# Altium schematic sheet Amplifier.schdoc: Amplifier
size A4; Organization: Altium Limited; Address1: L3, 12a Rodborough Rd; Address2: Frenchs Forest; Address3: NSW; Address4: Australia 2086; DocumentNumber: 2; SheetNumber: 2; SheetTotal: 3
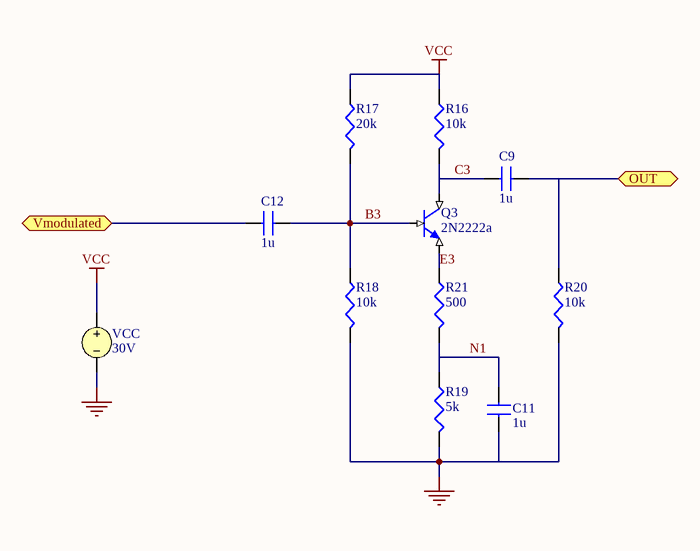
[diagram p0: Amplifier.schdoc]

## Parts
C9  1u
C11  1u
C12  1u
Q3  2N2222a
R16  10k
R17  20k
R18  10k
R19  5k
R20  10k
R21  500
VCC  30V

## Ports
OUT, Vmodulated

## Nets
GND: C11.1 R18.1(TOP) R19.1(TOP) R20.1(TOP) VCC.2
VCC: R16.2(BOT) R17.2(BOT) VCC.1
B3: C12.2 Q3.2(B) R17.1(TOP) R18.2(BOT)
C3: C9.1 Q3.1(C) R16.1(TOP)
E3: Q3.3(E) R21.2(BOT)
N1: C11.2 R19.2(BOT) R21.1(TOP)
OUT: C9.2 R20.2(BOT) ; port OUT
Vmodulated: C12.1 ; port Vmodulated

## Notes on the sheet
- Title
- Size:
- Date:
- A4
- Number:
- Time:
- Revision:
- Sheet
- of
- File:

## Library data of the parts
C9 C11 C12 = CAP: Capacitor; Value: 1u
Q3 = 2N2222a: NPN BJT
R16-R21 = RES: Resistor
  R16 R18 R20: Value: 10k
  R17: Value: 20k
  R19: Value: 5k
  R21: Value: 500
VCC = VSRC: Voltage Source; Value: 30V